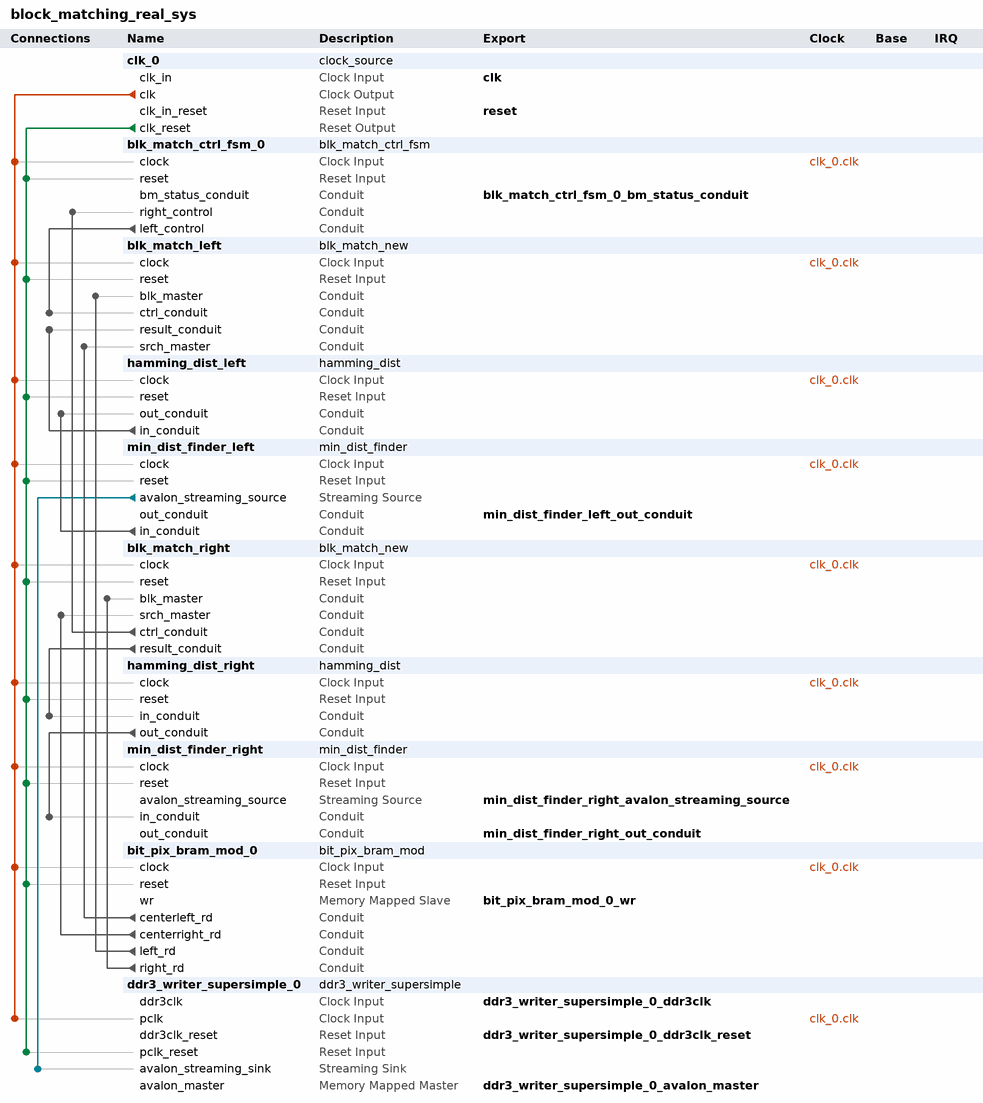
[diagram p0: system contents]
# Platform Designer (Qsys) system block_matching_real_sys, Cyclone V 5CSEBA6U23I7
# Parameters at their usual value, and those the tool derives, are not listed.
package require -exact qsys 18.1
create_system block_matching_real_sys
set_project_property DEVICE_FAMILY {Cyclone V}
set_project_property DEVICE 5CSEBA6U23I7

add_instance clk_0 clock_source 18.1
set_instance_parameter_value clk_0 clockFrequency 50000000

add_instance blk_match_ctrl_fsm_0 blk_match_ctrl_fsm 1.0
set_instance_parameter_value blk_match_ctrl_fsm_0 bit_frame_h 480
set_instance_parameter_value blk_match_ctrl_fsm_0 bit_frame_w 240
set_instance_parameter_value blk_match_ctrl_fsm_0 block_height 16
set_instance_parameter_value blk_match_ctrl_fsm_0 block_width 8
set_instance_parameter_value blk_match_ctrl_fsm_0 rd_port_w 8
set_instance_parameter_value blk_match_ctrl_fsm_0 search_blk_h 24
set_instance_parameter_value blk_match_ctrl_fsm_0 search_blk_w 32

add_instance blk_match_left blk_match_new 1.0
set_instance_parameter_value blk_match_left block_height 16
set_instance_parameter_value blk_match_left block_width 8
set_instance_parameter_value blk_match_left line_w 240
set_instance_parameter_value blk_match_left rd_port_w 8
set_instance_parameter_value blk_match_left search_blk_h 24
set_instance_parameter_value blk_match_left search_blk_w 32

add_instance hamming_dist_left hamming_dist 1.0
set_instance_parameter_value hamming_dist_left blk_size 128
set_instance_parameter_value hamming_dist_left lut_bits_in 4

add_instance min_dist_finder_left min_dist_finder 1.0
set_instance_parameter_value min_dist_finder_left blk_h 16
set_instance_parameter_value min_dist_finder_left blk_w 8
set_instance_parameter_value min_dist_finder_left search_blk_h 24
set_instance_parameter_value min_dist_finder_left search_blk_w 32

add_instance blk_match_right blk_match_new 1.0
set_instance_parameter_value blk_match_right block_height 16
set_instance_parameter_value blk_match_right block_width 8
set_instance_parameter_value blk_match_right line_w 240
set_instance_parameter_value blk_match_right rd_port_w 8
set_instance_parameter_value blk_match_right search_blk_h 24
set_instance_parameter_value blk_match_right search_blk_w 32

add_instance hamming_dist_right hamming_dist 1.0
set_instance_parameter_value hamming_dist_right blk_size 128
set_instance_parameter_value hamming_dist_right lut_bits_in 4

add_instance min_dist_finder_right min_dist_finder 1.0
set_instance_parameter_value min_dist_finder_right blk_h 16
set_instance_parameter_value min_dist_finder_right blk_w 8
set_instance_parameter_value min_dist_finder_right search_blk_h 24
set_instance_parameter_value min_dist_finder_right search_blk_w 32

add_instance bit_pix_bram_mod_0 bit_pix_bram_mod 1.0

add_instance ddr3_writer_supersimple_0 ddr3_writer_supersimple 1.0
set_instance_parameter_value ddr3_writer_supersimple_0 burst_len 2
set_instance_parameter_value ddr3_writer_supersimple_0 in_width 16
set_instance_parameter_value ddr3_writer_supersimple_0 num_pixels 5824
set_instance_parameter_value ddr3_writer_supersimple_0 start_address 905969664

# connections
add_connection clk_0.clk bit_pix_bram_mod_0.clock clock
add_connection clk_0.clk blk_match_ctrl_fsm_0.clock clock
add_connection clk_0.clk blk_match_left.clock clock
add_connection clk_0.clk blk_match_right.clock clock
add_connection clk_0.clk ddr3_writer_supersimple_0.pclk clock
add_connection clk_0.clk hamming_dist_left.clock clock
add_connection clk_0.clk hamming_dist_right.clock clock
add_connection clk_0.clk min_dist_finder_left.clock clock
add_connection clk_0.clk min_dist_finder_right.clock clock
add_connection clk_0.clk_reset bit_pix_bram_mod_0.reset reset
add_connection clk_0.clk_reset blk_match_ctrl_fsm_0.reset reset
add_connection clk_0.clk_reset blk_match_left.reset reset
add_connection clk_0.clk_reset blk_match_right.reset reset
add_connection clk_0.clk_reset ddr3_writer_supersimple_0.pclk_reset reset
add_connection clk_0.clk_reset hamming_dist_left.reset reset
add_connection clk_0.clk_reset hamming_dist_right.reset reset
add_connection clk_0.clk_reset min_dist_finder_left.reset reset
add_connection clk_0.clk_reset min_dist_finder_right.reset reset
add_connection min_dist_finder_left.avalon_streaming_source ddr3_writer_supersimple_0.avalon_streaming_sink avalon_streaming
add_connection bit_pix_bram_mod_0.centerleft_rd blk_match_left.srch_master conduit
add_connection bit_pix_bram_mod_0.centerright_rd blk_match_right.srch_master conduit
add_connection bit_pix_bram_mod_0.left_rd blk_match_left.blk_master conduit
add_connection bit_pix_bram_mod_0.right_rd blk_match_right.blk_master conduit
add_connection blk_match_ctrl_fsm_0.left_control blk_match_left.ctrl_conduit conduit
add_connection blk_match_right.ctrl_conduit blk_match_ctrl_fsm_0.right_control conduit
add_connection blk_match_right.result_conduit hamming_dist_right.in_conduit conduit
add_connection hamming_dist_left.in_conduit blk_match_left.result_conduit conduit
add_connection hamming_dist_right.out_conduit min_dist_finder_right.in_conduit conduit
add_connection min_dist_finder_left.in_conduit hamming_dist_left.out_conduit conduit

# exported interfaces
add_interface bit_pix_bram_mod_0_wr avalon slave
set_interface_property bit_pix_bram_mod_0_wr EXPORT_OF bit_pix_bram_mod_0.wr
add_interface blk_match_ctrl_fsm_0_bm_status_conduit conduit end
set_interface_property blk_match_ctrl_fsm_0_bm_status_conduit EXPORT_OF blk_match_ctrl_fsm_0.bm_status_conduit
add_interface clk clock sink
set_interface_property clk EXPORT_OF clk_0.clk_in
add_interface ddr3_writer_supersimple_0_avalon_master avalon master
set_interface_property ddr3_writer_supersimple_0_avalon_master EXPORT_OF ddr3_writer_supersimple_0.avalon_master
add_interface ddr3_writer_supersimple_0_ddr3clk clock sink
set_interface_property ddr3_writer_supersimple_0_ddr3clk EXPORT_OF ddr3_writer_supersimple_0.ddr3clk
add_interface ddr3_writer_supersimple_0_ddr3clk_reset reset sink
set_interface_property ddr3_writer_supersimple_0_ddr3clk_reset EXPORT_OF ddr3_writer_supersimple_0.ddr3clk_reset
add_interface min_dist_finder_left_out_conduit conduit end
set_interface_property min_dist_finder_left_out_conduit EXPORT_OF min_dist_finder_left.out_conduit
add_interface min_dist_finder_right_avalon_streaming_source avalon_streaming source
set_interface_property min_dist_finder_right_avalon_streaming_source EXPORT_OF min_dist_finder_right.avalon_streaming_source
add_interface min_dist_finder_right_out_conduit conduit end
set_interface_property min_dist_finder_right_out_conduit EXPORT_OF min_dist_finder_right.out_conduit
add_interface reset reset sink
set_interface_property reset EXPORT_OF clk_0.clk_in_reset

set_interconnect_requirement {$system} qsys_mm.clockCrossingAdapter HANDSHAKE
set_interconnect_requirement {$system} qsys_mm.enableEccProtection FALSE
set_interconnect_requirement {$system} qsys_mm.insertDefaultSlave FALSE
set_interconnect_requirement {$system} qsys_mm.maxAdditionalLatency 1

save_system block_matching_real_sys.qsys
